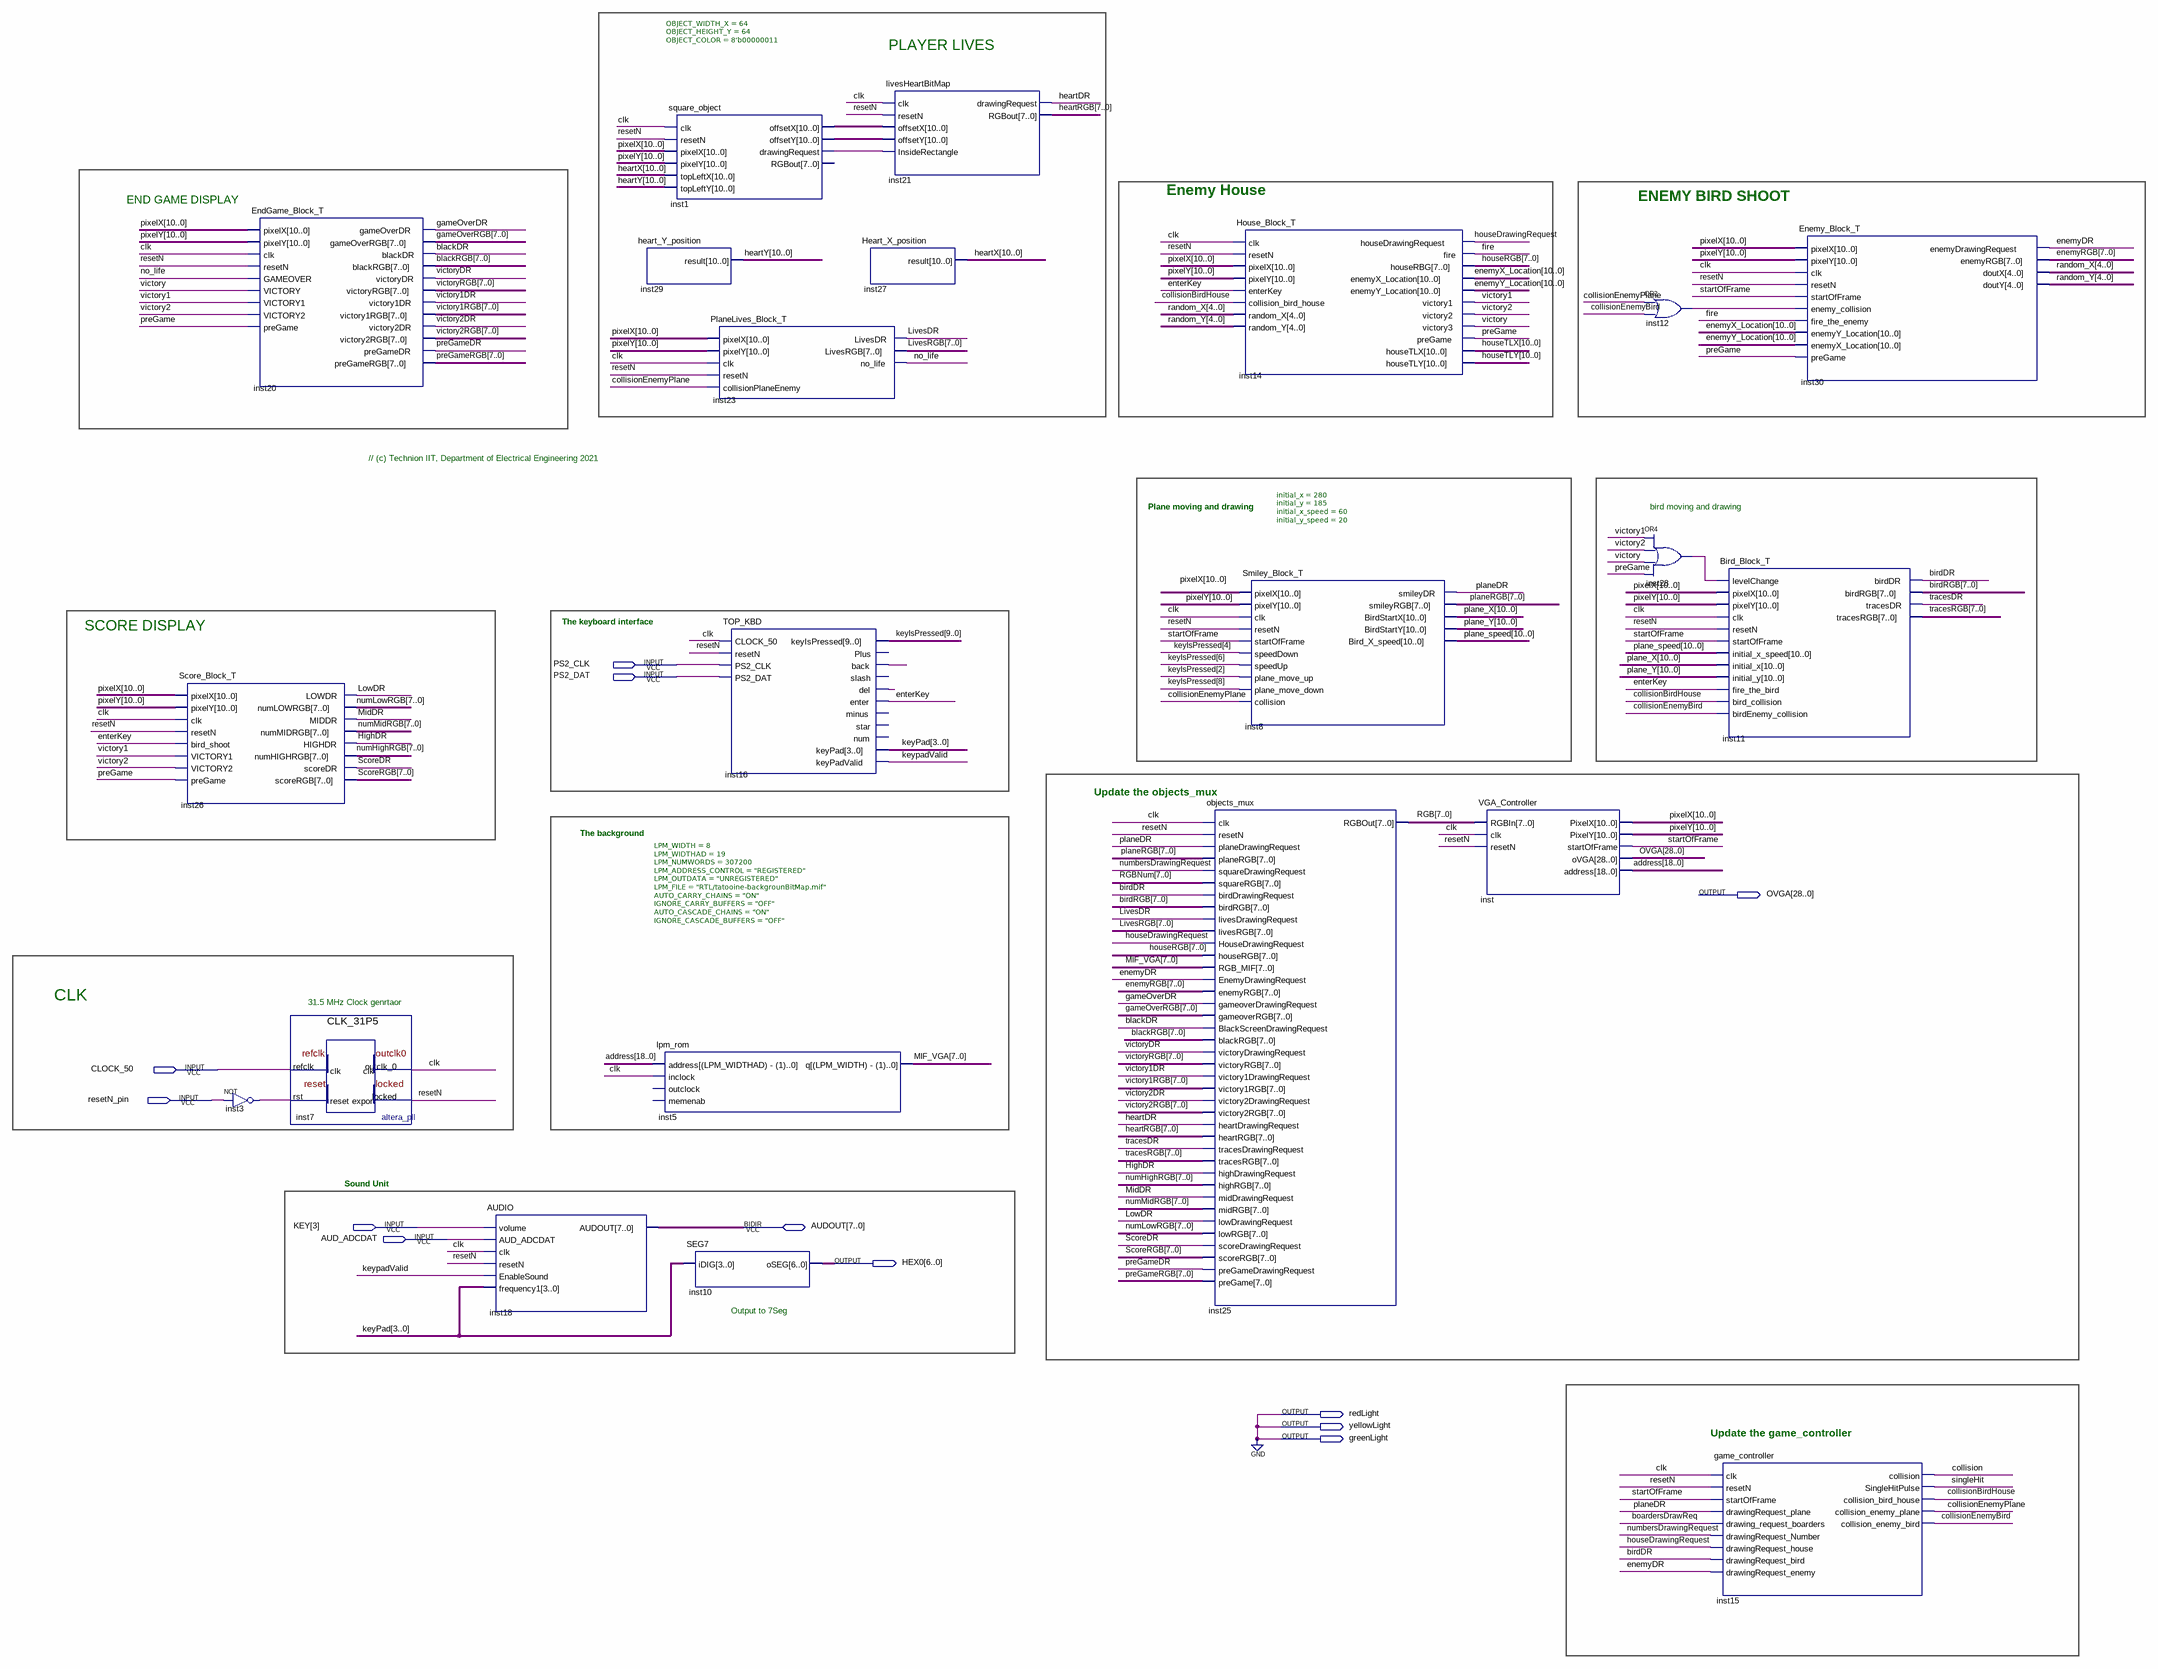
[diagram p0: schematic sheet]
// Quartus schematic TOP_VGA_DEMO_KBD.bdf as structural Verilog: 22 symbols, 12 pins
module TOP_VGA_DEMO_KBD (
  input  PS2_CLK,
  input  PS2_DAT,
  input  CLOCK_50,
  input  resetN_pin,
  input  [3:3] KEY,
  input  AUD_ADCDAT,
  inout  [7:0] AUDOUT,
  output [28:0] OVGA,
  output [6:0] HEX0,
  output redLight,
  output yellowLight,
  output greenLight
);

  wire birdDR, blackDR, boardersDrawReq, clk, collision, collisionBirdHouse, collisionEnemyBird,
       collisionEnemyPlane, enemyDR, enterKey, fire, gameOverDR, heartDR, HighDR, houseDrawingRequest,
       inst1_drawingrequest, inst3_out, inst12_out, inst16_back, inst16_del, inst28_out, keypadValid,
       LivesDR, LowDR, MidDR, no_life, numbersDrawingRequest, planeDR, preGame, preGameDR, resetN, ScoreDR,
       singleHit, startOfFrame, tracesDR, victory, victory1, victory1DR, victory2, victory2DR, victoryDR;
  wire [3:0] keyPad;
  wire [4:0] random_X, random_Y;
  wire [7:0] birdRGB, blackRGB, enemyRGB, gameOverRGB, heartRGB, houseRGB, LivesRGB, MIF_VGA, numHighRGB,
       numLowRGB, numMidRGB, planeRGB, preGameRGB, RGB, RGBNum, ScoreRGB, tracesRGB, victory1RGB,
       victory2RGB, victoryRGB;
  wire [9:0] keyIsPressed;
  wire [10:0] enemyX_Location, enemyY_Location, heartX, heartY, houseTLX, houseTLY, inst1_offsetx,
       inst1_offsety, pixelX, pixelY, plane_speed, plane_X, plane_Y;
  wire [18:0] address;

  Score_Block_T inst26 (
    .pixelX(pixelX), .pixelY(pixelY), .clk(clk), .resetN(resetN), .bird_shoot(enterKey), .VICTORY1(victory1),
    .VICTORY2(victory2), .preGame(preGame), .LOWDR(LowDR), .numLOWRGB(numLowRGB), .MIDDR(MidDR),
    .numMIDRGB(numMidRGB), .HIGHDR(HighDR), .numHIGHRGB(numHighRGB), .scoreDR(ScoreDR), .scoreRGB(ScoreRGB));
  EndGame_Block_T inst20 (
    .pixelX(pixelX), .pixelY(pixelY), .clk(clk), .resetN(resetN), .GAMEOVER(no_life), .VICTORY(victory),
    .VICTORY1(victory1), .VICTORY2(victory2), .preGame(preGame), .gameOverDR(gameOverDR),
    .gameOverRGB(gameOverRGB), .blackDR(blackDR), .blackRGB(blackRGB), .victoryDR(victoryDR),
    .victoryRGB(victoryRGB), .victory1DR(victory1DR), .victory1RGB(victory1RGB), .victory2DR(victory2DR),
    .victory2RGB(victory2RGB), .preGameDR(preGameDR), .preGameRGB(preGameRGB));
  not inst3 (inst3_out, resetN_pin);
  CLK_31P5 inst7 (.refclk(CLOCK_50), .rst(inst3_out), .outclk_0(clk), .locked(resetN));
  AUDIO inst18 (
    .volume(KEY[3]), .AUD_ADCDAT(AUD_ADCDAT), .clk(clk), .resetN(resetN), .EnableSound(keypadValid),
    .frequency1(keyPad), .AUDOUT(AUDOUT));
  heart_Y_position inst29 (.result(heartY));
  square_object #(.OBJECT_WIDTH_X(64), .OBJECT_HEIGHT_Y(64), .OBJECT_COLOR(8'b00000011)) inst1 (
    .clk(clk), .resetN(resetN), .pixelX(pixelX), .pixelY(pixelY), .topLeftX(heartX), .topLeftY(heartY),
    .offsetX(inst1_offsetx), .offsetY(inst1_offsety), .drawingRequest(inst1_drawingrequest));  // open: RGBout
  lpm_rom #(.LPM_WIDTH(8), .LPM_WIDTHAD(19), .LPM_NUMWORDS(307200), .LPM_ADDRESS_CONTROL("REGISTERED"), .LPM_OUTDATA("UNREGISTERED"), .LPM_FILE("RTL/tatooine-backgrounBitMap.mif"), .AUTO_CARRY_CHAINS("ON"), .IGNORE_CARRY_BUFFERS("OFF"), .AUTO_CASCADE_CHAINS("ON"), .IGNORE_CASCADE_BUFFERS("OFF")) inst5 (
    .address(address), .inclock(clk), .q(MIF_VGA));  // open: outclock, memenab
  SEG7 inst10 (.iDIG(keyPad), .oSEG(HEX0));
  PlaneLives_Block_T inst23 (
    .pixelX(pixelX), .pixelY(pixelY), .clk(clk), .resetN(resetN), .collisionPlaneEnemy(collisionEnemyPlane),
    .LivesDR(LivesDR), .LivesRGB(LivesRGB), .no_life(no_life));
  TOP_KBD inst16 (
    .CLOCK_50(clk), .resetN(resetN), .PS2_CLK(PS2_CLK), .PS2_DAT(PS2_DAT), .keyIsPressed(keyIsPressed),
    .back(inst16_back), .del(inst16_del), .enter(enterKey), .keyPad(keyPad), .keyPadValid(keypadValid));  // open: Plus, slash, minus, star, num
  livesHeartBitMap inst21 (
    .clk(clk), .resetN(resetN), .offsetX(inst1_offsetx), .offsetY(inst1_offsety),
    .InsideRectangle(inst1_drawingrequest), .drawingRequest(heartDR), .RGBout(heartRGB));
  Heart_X_position inst27 (.result(heartX));
  objects_mux inst25 (
    .clk(clk), .resetN(resetN), .planeDrawingRequest(planeDR), .planeRGB(planeRGB),
    .squareDrawingRequest(numbersDrawingRequest), .squareRGB(RGBNum), .birdDrawingRequest(birdDR),
    .birdRGB(birdRGB), .livesDrawingRequest(LivesDR), .livesRGB(LivesRGB),
    .HouseDrawingRequest(houseDrawingRequest), .houseRGB(houseRGB), .RGB_MIF(MIF_VGA),
    .EnemyDrawingRequest(enemyDR), .enemyRGB(enemyRGB), .gameoverDrawingRequest(gameOverDR),
    .gameoverRGB(gameOverRGB), .BlackScreenDrawingRequest(blackDR), .blackRGB(blackRGB),
    .victoryDrawingRequest(victoryDR), .victoryRGB(victoryRGB), .victory1DrawingRequest(victory1DR),
    .victory1RGB(victory1RGB), .victory2DrawingRequest(victory2DR), .victory2RGB(victory2RGB),
    .heartDrawingRequest(heartDR), .heartRGB(heartRGB), .tracesDrawingRequest(tracesDR),
    .tracesRGB(tracesRGB), .highDrawingRequest(HighDR), .highRGB(numHighRGB), .midDrawingRequest(MidDR),
    .midRGB(numMidRGB), .lowDrawingRequest(LowDR), .lowRGB(numLowRGB), .scoreDrawingRequest(ScoreDR),
    .scoreRGB(ScoreRGB), .preGameDrawingRequest(preGameDR), .preGame(preGameRGB), .RGBOut(RGB));
  House_Block_T inst14 (
    .clk(clk), .resetN(resetN), .pixelX(pixelX), .pixelY(pixelY), .enterKey(enterKey),
    .collision_bird_house(collisionBirdHouse), .random_X(random_X), .random_Y(random_Y),
    .houseDrawingRequest(houseDrawingRequest), .fire(fire), .houseRBG(houseRGB),
    .enemyX_Location(enemyX_Location), .enemyY_Location(enemyY_Location), .victory1(victory1),
    .victory2(victory2), .victory3(victory), .preGame(preGame), .houseTLX(houseTLX), .houseTLY(houseTLY));
  Smiley_Block_T #(.initial_x(280), .initial_y(185), .initial_x_speed(60), .initial_y_speed(20)) inst8 (
    .pixelX(pixelX), .pixelY(pixelY), .clk(clk), .resetN(resetN), .startOfFrame(startOfFrame),
    .speedDown(keyIsPressed[4]), .speedUp(keyIsPressed[6]), .plane_move_up(keyIsPressed[2]),
    .plane_move_down(keyIsPressed[8]), .collision(collisionEnemyPlane), .smileyDR(planeDR),
    .smileyRGB(planeRGB), .BirdStartX(plane_X), .BirdStartY(plane_Y), .Bird_X_speed(plane_speed));
  VGA_Controller inst (
    .RGBIn(RGB), .clk(clk), .resetN(resetN), .PixelX(pixelX), .PixelY(pixelY), .startOfFrame(startOfFrame),
    .oVGA(OVGA), .address(address));
  or inst12 (inst12_out, collisionEnemyPlane, collisionEnemyBird);
  or inst28 (inst28_out, victory1, victory2, victory, preGame);
  game_controller inst15 (
    .clk(clk), .resetN(resetN), .startOfFrame(startOfFrame), .drawingRequest_plane(planeDR),
    .drawing_request_boarders(boardersDrawReq), .drawingRequest_Number(numbersDrawingRequest),
    .drawingRequest_house(houseDrawingRequest), .drawingRequest_bird(birdDR), .drawingRequest_enemy(enemyDR),
    .collision(collision), .SingleHitPulse(singleHit), .collision_bird_house(collisionBirdHouse),
    .collision_enemy_plane(collisionEnemyPlane), .collision_enemy_bird(collisionEnemyBird));
  Bird_Block_T inst11 (
    .levelChange(inst28_out), .pixelX(pixelX), .pixelY(pixelY), .clk(clk), .resetN(resetN),
    .startOfFrame(startOfFrame), .initial_x_speed(plane_speed), .initial_x(plane_X), .initial_y(plane_Y),
    .fire_the_bird(enterKey), .bird_collision(collisionBirdHouse), .birdEnemy_collision(collisionEnemyBird),
    .birdDR(birdDR), .birdRGB(birdRGB), .tracesDR(tracesDR), .tracesRGB(tracesRGB));
  Enemy_Block_T inst30 (
    .pixelX(pixelX), .pixelY(pixelY), .clk(clk), .resetN(resetN), .startOfFrame(startOfFrame),
    .enemy_collision(inst12_out), .fire_the_enemy(fire), .enemyY_Location(enemyX_Location),
    .enemyX_Location(enemyY_Location), .preGame(preGame), .enemyDrawingRequest(enemyDR), .enemyRGB(enemyRGB),
    .doutX(random_X), .doutY(random_Y));

  assign greenLight = 1'b0;
  assign redLight = 1'b0;
  assign yellowLight = 1'b0;

  // Notes on the sheet:
  //   PLAYER LIVES
  //   Enemy House
  //   ENEMY BIRD SHOOT
  //   END GAME DISPLAY
  //   // (c) Technion IIT, Department of Electrical Engineering 2021
  //   Plane moving and drawing
  //   bird moving and drawing
  //   SCORE DISPLAY
  //   The keyboard interface
  //   Update the objects_mux
  //   The background
  //   CLK
  //   31.5 MHz Clock genrtaor
  //   Sound Unit
  //   Output to 7Seg
  //   Update the game_controller
endmodule
